# EAGLE design main (EAGLE 6.3)
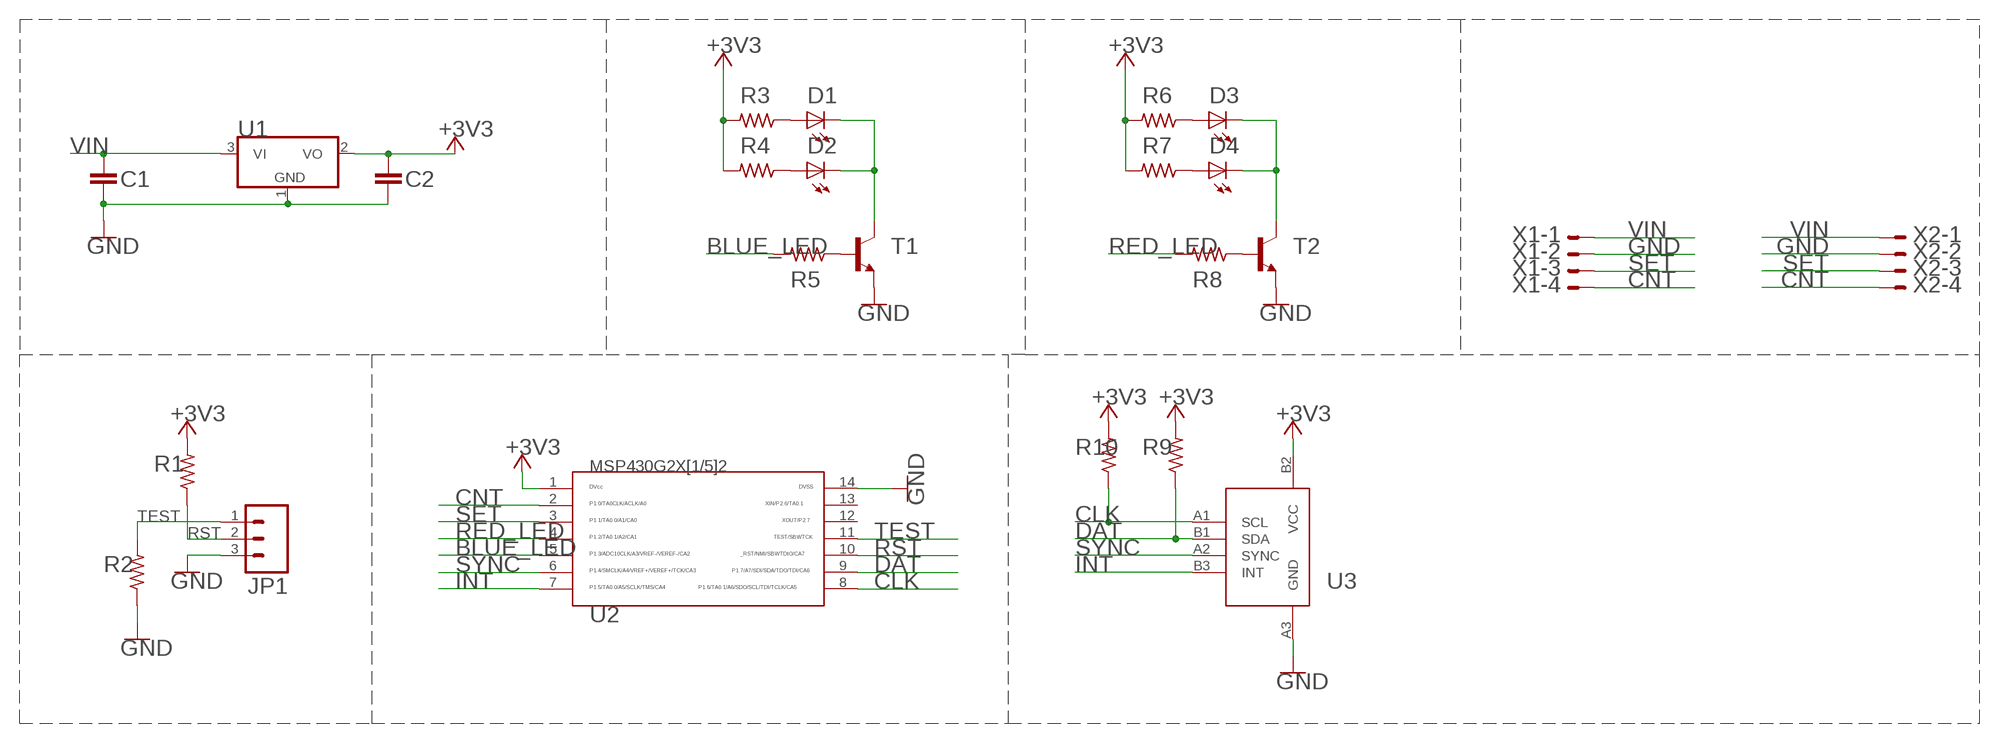
[diagram p0: schematic, sheet 1]

## Parts
C1  C1608X5R1C106M080AB  CAP0603-CAP  [0603-CAP]
C2  C1608X5R1C106M080AB  CAP0603-CAP  [0603-CAP]
D1  VLMB1300-GS08  LED0603  [LED-0603]
D2  VLMB1300-GS08  LED0603  [LED-0603]
D3  VLMS1300-GS08  LED0603  [LED-0603]
D4  VLMS1300-GS08  LED0603  [LED-0603]
JP1  M03PTH  [1X03]
R1  RK73H1JTTD4702F  R-US_R0603  [R0603]
R2  RK73H1JTTD4702F  R-US_R0603  [R0603]
R3  CRCW0603200RFKEA  R-US_R0603  [R0603]
R4  CRCW0603200RFKEA  R-US_R0603  [R0603]
R5  CRCW0603200RFKEA  R-US_R0603  [R0603]
R6  CRCW0603200RFKEA  R-US_R0603  [R0603]
R7  CRCW0603200RFKEA  R-US_R0603  [R0603]
R8  CRCW0603200RFKEA  R-US_R0603  [R0603]
R9  RK73H1JTTD4701F  R-US_R0603  [R0603]
R10  RK73H1JTTD4701F  R-US_R0603  [R0603]
T1  PMBT4401,215  MMBT4401LT1-NPN-SOT23-BEC  [SOT23-BEC]
T2  PMBT4401,215  MMBT4401LT1-NPN-SOT23-BEC  [SOT23-BEC]
U1  MCP1703T-3002E/CB  MCP1703CB  [SOT23]
U2  MSP430G2452IPW14R  G2X[1/5]2---PW14  [PW14]
U3  TCS3414CS  [CS-6]
X1  DF13-4P-1.25V(50)  53398-04  [53398-04]
X2  DF13-4P-1.25V(50)  53398-04  [53398-04]

## Nets
+3V3: C2.1 R1.2 R3.2 R4.2 R6.2 R7.2 R9.2 R10.2 U1.2(VO) U2.1 U3.B2(VCC)
BLUE_LED: R5.2 U2.5
CLK: R10.1 U2.8 U3.A1(SCL)
CNT: U2.2 X1.4 X2.4
DAT: R9.1 U2.9 U3.B1(SDA)
GND: C1.2 C2.2 JP1.3 R2.1 T1.E T2.E U1.1(GND) U2.14 U3.A3(GND) X1.2 X2.2
INT: U2.7 U3.B3(INT)
LED: D1.C D2.C T1.C
N$1: D4.A R7.1
N$2: D3.C D4.C T2.C
N$4: R8.1 T2.B
N$6: D2.A R4.1
N$7: D1.A R3.1
N$10: D3.A R6.1
N$18: R5.1 T1.B
RED_LED: R8.2 U2.4
RST: JP1.2 R1.1 U2.10
SET: U2.3 X1.3 X2.3
SYNC: U2.6 U3.A2(SYNC)
TEST: JP1.1 R2.2 U2.11
VIN: C1.1 U1.3(VI) X1.1 X2.1
Unconnected: U2.12 U2.13

## Library data of the parts
C1 C2 = SparkFun-Passives:CAP: Capacitor Standard 0603 ceramic capacitor, and 0.1" leaded capacitor.
D1-D4 = SparkFun-LED:LED: LEDs Standard schematic elements and footprints for 5mm, 3mm, 1206, and 0603 sized LEDs. 5mm - Spark Fun Electronics SKU : COM-00529 (and others)
JP1 = SparkFun-Connectors:M03: Header 3 Standard 3-pin 0.1" header. Use with straight break away headers (SKU : PRT-00116), right angle break away headers (PRT-00553), swiss pins (PRT-00743), machine pins (PRT-00117), and female headers (PRT-00115). Molex polarized connector foot print use with SKU : PRT-08232 with associated crimp pins and housings.
R1-R10 = rcl:R-US_: RESISTOR, American symbol
T1 T2 = transistor:*-NPN-: NPN Transistror BF959 corrected 2008.03.06
U1 = linear:MCP1703: 250 mA, 16V, Low Quiescent Current LDO Regulator Source: http://ww1.microchip.com/downloads/en/DeviceDoc/22049b.pdf
U2 = TI_MSP430_v16:G2X[1/5]2---PW14: MSP430G2X[1/5]2 MSP430G2x52, MSP430G2x12 TSSOP (PW) 14 Pin Package http://focus.ti.com/docs/prod/folders/print/msp430g2452.html
U3 = torpedo:TCS3414
X1 X2 = con-molex:53?-04: CONNECTOR wire to board 1.25 mm (.049 inch) pitch header; OC_FARNELL: 1125367; OC_NEWARK: unknown

## Board
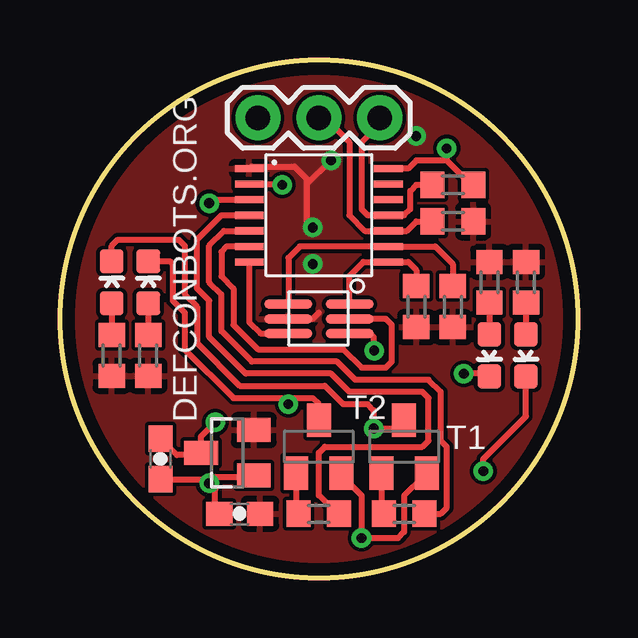
[diagram p1: board, top side]
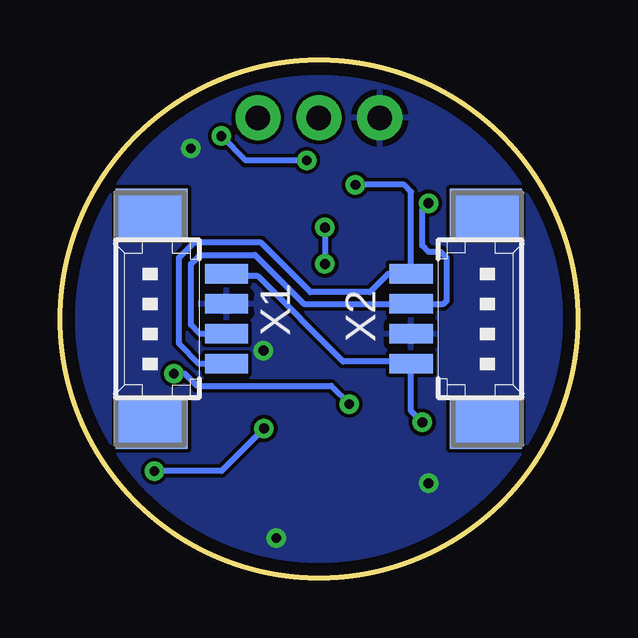
[diagram p2: board, bottom side, seen from below]

Size 21.59 x 21.59 mm. Coordinates in mm from the lower left corner, seen from the top.
Outline: circle at 10.79,10.79 radius 10.79
Copper layers (1*16): Top 0.035mm / dielectric 1.5mm / Bottom 0.035mm
Design rules "default *": minimum track width 6mil, minimum drill 16mil, track to track 6mil, track to pad 6mil, pad to pad 6mil, via to via 6mil, smd to smd 6mil, copper to edge 20mil, drill to drill 8mil, minimum pad ring 10mil, minimum via ring 8mil, stop-mask expansion 4mil, vias tented up to drill 20mil, thermal gap 10mil

### Footprints (pad centres in the part's own frame; a part is rotated, then mirrored left to right if it is on the bottom)
0603-CAP = smd 1.1 x 1: 1 -0.85,0; 2 0.85,0
LED-0603 = smd 1 x 1: A 0,-0.877; C 0,0.877
1X03 = drill 1.016 pad 1.88: 1 0,0; 2 2.54,0; 3 5.08,0
R0603 = smd 1 x 1.1: 1 -0.85,0; 2 0.85,0
SOT23-BEC = smd 1 x 1.4: B -0.95,-1.1; C 0,1.1; E 0.95,-1.1
SOT23 = smd 1 x 1.4: 1 -0.95,-1.1; 2 0.95,-1.1; 3 0,1.1
PW14 = smd 0.3 x 1.2: 1 -1.95,-2.9; 2 -1.3,-2.9; 3 -0.65,-2.9; 4 0,-2.9; 5 0.65,-2.9; 6 1.3,-2.9; 7 1.95,-2.9; 8 1.95,2.9; 9 1.3,2.9; 10 0.65,2.9; 11 0,2.9; 12 -0.65,2.9; 13 -1.3,2.9; 14 -1.95,2.9
CS-6 = smd 0.4 x 2: A1 -0.61,1.28; A2 0,1.28; A3 0.61,1.28; B1 -0.61,-1.27; B2 0,-1.27; B3 0.61,-1.27
53398-04 = smd 0.8 x 1.8: 1 1.875,-2.5; 2 0.625,-2.5; 3 -0.625,-2.5; 4 -1.875,-2.5 | smd 2.1 x 3: S1 4.375,0.625; S2 -4.375,0.625

### Placement (x,y rotation side)
C1  4.19,4.95 270 top
C2  7.49,2.67 180 top
D1  19.43,9.27 180 top
D2  2.16,12.32 0 top
D3  17.91,9.27 180 top
D4  3.68,12.32 0 top
JP1  13.33,19.18 180 top
R1  16.38,14.86 0 top
R2  16.38,16.38 180 top
R3  19.43,12.32 90 top
R4  2.16,9.27 270 top
R5  14.35,2.67 0 top
R6  17.91,12.32 90 top
R7  3.68,9.27 270 top
R8  10.79,2.67 0 top
R9  16.38,11.3 270 top
R10  14.86,11.3 270 top
T1  14.35,5.46 0 top
T2  10.79,5.46 0 top
U1  6.98,5.21 90 top
U2  10.79,15.11 270 top
U3  10.79,10.79 270 top
X1  17.14,10.79 90 bottom
X2  4.44,10.79 270 bottom

### Tracks (layer width: path | path; a pad name or v marks a point on that pad's centre or on a via)
+3V3  (via drill 0.41)
  Top 0.254: v10.54,14.6 10.29,14.86 10.29,16.38 | 10.29,16.38 10.29,16.64 9.78,17.14 8,17.14 U2.1 | U3.B2 10.54,10.79 10.79,11.05 | 10.29,16.38 v11.3,17.4
  Bottom 0.254: v10.54,14.6 v10.54,13.08 | v14.86,18.41 13.84,17.4 v11.3,17.4
  pour Top: 0.13,0.13 21.46,0.13 21.72,21.46 -0.13,21.46
BLUE_LED
  Top 0.254: R5.2 15.87,2.67 16.13,2.92 16.13,5.46 15.87,5.71 15.87,7.75 15.37,8.25 12.32,8.25 11.56,9.02 8,9.02 6.73,10.29 6.73,11.81 6.22,12.32 6.22,13.84 6.84,14.46 U2.5
CLK
  Top 0.254: U3.A1 12.07,12.58 12.65,13.16 U2.8 14.52,13.16 14.86,12.83 R10.1
CNT  (via drill 0.41)
  Top 0.254: v9.27,16.38 7.92,16.38 U2.2
  Bottom 0.254: v9.27,16.38 7.24,16.38 6.94,16.09 X2.4 7.9,12.67 8.67,11.91 11.15,11.91 13.21,13.97 16,13.97 16.64,13.33 16.64,9.78 15.78,8.92 X1.4
DAT
  Top 0.254: U3.B1 9.52,13.33 10,13.81 U2.9 15.65,13.81 16.38,13.08 R9.1
GND  (via drill 0.41)
  Top 0.254: C2.2 6.48,2.67 6.48,3.68 v6.22,3.94 | U1.1 8,4.19 6.48,4.19 v6.22,3.94 | U3.A3 12.93,10.18 13.08,10.03 13.08,9.47 v13.11,9.47 | T1.E 15.11,4.19 14.35,3.43 14.35,1.9 14.1,1.65 12.83,1.65 12.57,1.9 | 12.57,1.9 12.57,3.43 12.06,3.94 11.81,3.94 11.81,4.19 T2.E | 12.57,1.9 v12.57,1.65 | C1.2 6.06,4.1 v6.22,3.94 | 16.13,17.4 14.86,17.4 14.52,17.06 U2.14 | 16.13,17.4 v16.13,17.91 | R2.1 17.14,16.38 16.13,17.4
  pour Bottom: 0.13,0.13 21.46,0.13 21.72,21.46 -0.13,21.46
INT
  Top 0.254: U2.7 7.89,10.65 8.36,10.18 U3.B3
LED  (via drill 0.41)
  Top 0.254: D2.C 2.16,13.84 2.41,14.1 4.95,14.1 5.21,13.84 5.21,11.81 5.71,11.3 5.71,9.78 7.49,8 11.05,8 11.81,7.24 12.83,7.24 13.08,6.98 v13.08,6.22 14.35,6.22 T1.C | D1.C 19.43,6.73 17.65,4.95 v17.65,4.44
  Bottom 0.254: v17.65,4.44 14.86,4.44 v13.08,6.22
N$1
  Top 0.254: D4.A R7.1
N$2  (via drill 0.41)
  Top 0.254: D4.C 4.58,13.2 4.7,13.08 4.7,11.56 5.21,11.05 5.21,9.52 7.24,7.49 9.52,7.49 | 9.52,7.49 10.54,7.49 10.79,7.24 T2.C | v9.52,7.24 9.52,7.49 | v16.84,8.51 17.91,8.51 D3.C
  Bottom 0.254: v9.52,7.24 10.29,8 15.87,8 16.38,8.51 v16.84,8.51
N$4
  Top 0.254: T2.B 9.84,2.77 R8.1
N$6
  Top 0.254: D2.A R4.1
N$7
  Top 0.254: R3.1 D1.A
N$10
  Top 0.254: R6.1 D3.A
N$18
  Top 0.254: T1.B 13.4,2.77 R5.1
RED_LED
  Top 0.254: R8.2 11.56,2.67 10.79,3.43 10.79,5.21 11.05,5.46 15.11,5.46 15.37,5.71 15.37,7.49 15.11,7.75 12.06,7.75 11.3,8.51 7.75,8.51 6.22,10.03 6.22,11.56 5.71,12.06 5.71,14.1 6.73,15.11 U2.4
RST
  Top 0.254: R1.1 14.86,14.86 14.46,14.46 U2.10 12.71,14.46 12.06,15.11 12.06,18.16 11.05,19.18 JP1.2
SET  (via drill 0.41)
  Top 0.254: v6.22,15.62 6.36,15.76 U2.3
  Bottom 0.254: v6.22,15.62 6.48,15.37 6.48,13.84 6.22,13.59 5.71,13.59 5.46,13.33 5.46,11.56 5.6,11.42 X2.3 11.42,11.42 13.46,13.46 15.75,13.46 16.13,13.08 16.13,10.54 15.76,10.17 X1.3
SYNC
  Top 0.254: U2.6 6.95,13.81 6.73,13.59 6.73,12.57 7.24,12.06 7.24,10.54 8.25,9.52 11.81,9.52 12.57,8.76 13.59,8.76 13.84,9.02 13.84,10.54 13.59,10.79 U3.A2 | U3.A2
TEST
  Top 0.254: R2.2 14.86,16.38 14.6,16.13 14.6,15.37 14.35,15.11 U2.11 12.83,15.11 12.57,15.37 12.57,18.16 13.33,18.92 JP1.1
VIN  (via drill 0.41)
  Top 0.254: C1.1 4.87,5.12 5.8,5.12 U1.3 5.88,5.88 v6.48,6.48
  Bottom 0.254: X1.1 14.6,12.57 13.33,12.57 9.78,9.02 6.98,9.02 X2.1 6.94,6.94 v6.48,6.48

### Text on the board
tPlace: DEFCONBOTS.ORG